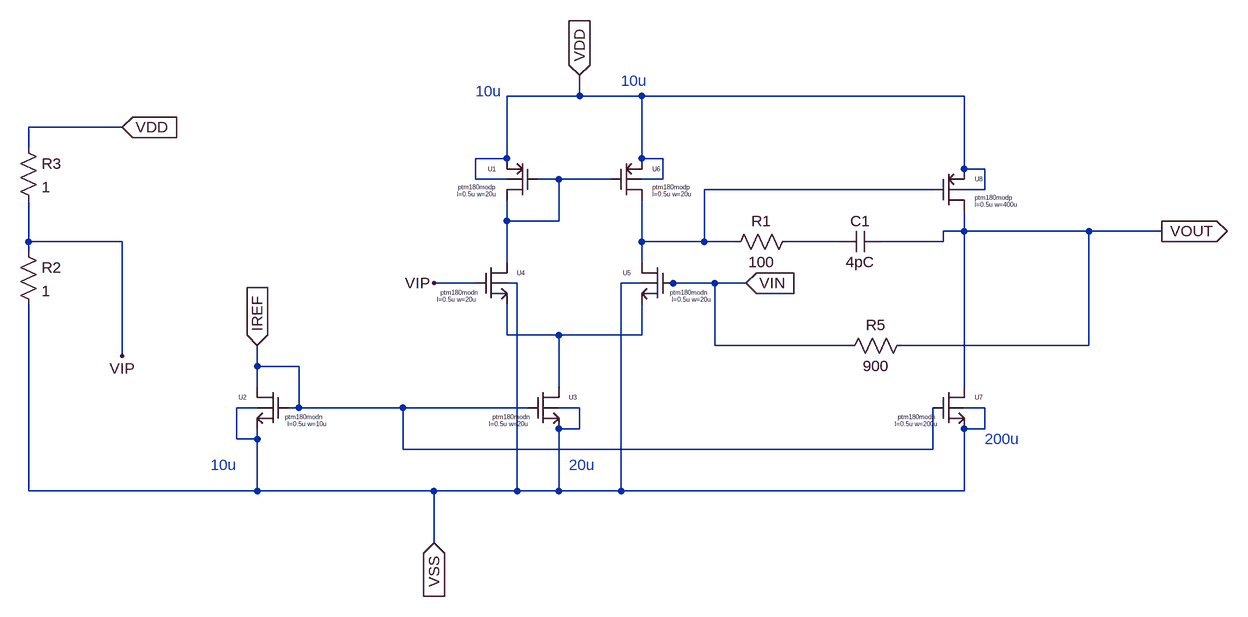
[diagram p0: schematic cm_amp.asc]
cm_amp.asc, the LTspice schematic file:
Version 4
SHEET 1 1404 828
WIRE 400 48 400 16
WIRE 400 48 288 48
WIRE 496 48 400 48
WIRE 992 48 496 48
WIRE -304 96 -448 96
WIRE -448 128 -448 96
WIRE 288 144 288 48
WIRE 288 144 240 144
WIRE 496 144 496 48
WIRE 528 144 496 144
WIRE 992 160 992 48
WIRE 1024 160 992 160
WIRE 240 176 240 144
WIRE 288 176 240 176
WIRE 368 176 336 176
WIRE 448 176 368 176
WIRE 528 176 528 144
WIRE 528 176 496 176
WIRE 944 192 592 192
WIRE 1024 192 1024 160
WIRE 1024 192 992 192
WIRE 288 240 288 208
WIRE 368 240 368 176
WIRE 368 240 288 240
WIRE 992 256 992 224
WIRE 992 256 960 256
WIRE 1184 256 992 256
WIRE 1296 256 1184 256
WIRE -448 272 -448 208
WIRE -304 272 -448 272
WIRE 496 272 496 208
WIRE 592 272 592 192
WIRE 592 272 496 272
WIRE 640 272 592 272
WIRE 800 272 720 272
WIRE 960 272 960 256
WIRE 960 272 864 272
WIRE -448 288 -448 272
WIRE 288 304 288 240
WIRE 496 304 496 272
WIRE 240 336 176 336
WIRE 304 336 288 336
WIRE 496 336 464 336
WIRE 544 336 528 336
WIRE 608 336 544 336
WIRE 656 336 608 336
WIRE 288 416 288 368
WIRE 368 416 288 416
WIRE 496 416 496 368
WIRE 496 416 368 416
WIRE 608 432 608 336
WIRE 816 432 608 432
WIRE 1184 432 1184 256
WIRE 1184 432 896 432
WIRE -304 448 -304 272
WIRE -96 464 -96 432
WIRE -32 464 -96 464
WIRE -96 496 -96 464
WIRE 368 496 368 416
WIRE 992 496 992 256
WIRE -96 528 -128 528
WIRE -32 528 -32 464
WIRE -32 528 -48 528
WIRE 128 528 -32 528
WIRE 320 528 128 528
WIRE 400 528 368 528
WIRE 1024 528 992 528
WIRE 400 560 400 528
WIRE 400 560 368 560
WIRE 1024 560 1024 528
WIRE 1024 560 992 560
WIRE -128 576 -128 528
WIRE -96 576 -96 560
WIRE -96 576 -128 576
WIRE 128 592 128 528
WIRE 944 592 944 528
WIRE 944 592 128 592
WIRE -448 656 -448 368
WIRE -96 656 -96 576
WIRE -96 656 -448 656
WIRE 176 656 -96 656
WIRE 304 656 304 336
WIRE 304 656 176 656
WIRE 368 656 368 560
WIRE 368 656 304 656
WIRE 464 656 464 336
WIRE 464 656 368 656
WIRE 992 656 992 560
WIRE 992 656 464 656
WIRE 176 736 176 656
FLAG -96 432 IREF
IOPIN -96 432 In
FLAG 176 736 VSS
IOPIN 176 736 In
FLAG 400 16 VDD
IOPIN 400 16 In
FLAG 1296 256 VOUT
IOPIN 1296 256 Out
FLAG 656 336 VIN
IOPIN 656 336 In
FLAG 176 336 VIP
FLAG -304 448 VIP
FLAG -304 96 VDD
IOPIN -304 96 In
SYMBOL cnm25mod_pmos4 336 144 M0
SYMATTR SpiceModel ptm180modp
SYMATTR Value l=0.5u w=20u
SYMATTR InstName U1
SYMBOL cnm25mod_nmos4 -48 496 M0
WINDOW 38 -54 46 Left 0
WINDOW 3 -59 57 Left 0
SYMATTR SpiceModel ptm180modn
SYMATTR Value l=0.5u w=10u
SYMATTR InstName U2
SYMBOL cnm25mod_nmos4 320 496 R0
WINDOW 38 -54 46 Left 0
WINDOW 3 -59 57 Left 0
SYMATTR SpiceModel ptm180modn
SYMATTR Value l=0.5u w=20u
SYMATTR InstName U3
SYMBOL cnm25mod_nmos4 240 304 R0
WINDOW 38 -54 46 Left 0
WINDOW 3 -59 57 Left 0
SYMATTR SpiceModel ptm180modn
SYMATTR Value l=0.5u w=20u
SYMATTR InstName U4
SYMBOL cnm25mod_nmos4 544 304 M0
WINDOW 38 -54 46 Left 0
WINDOW 3 -59 57 Left 0
SYMATTR SpiceModel ptm180modn
SYMATTR Value l=0.5u w=20u
SYMATTR InstName U5
SYMBOL cnm25mod_pmos4 448 144 R0
SYMATTR SpiceModel ptm180modp
SYMATTR Value l=0.5u w=20u
SYMATTR InstName U6
SYMBOL cnm25mod_nmos4 944 496 R0
WINDOW 38 -54 46 Left 0
WINDOW 3 -59 57 Left 0
SYMATTR SpiceModel ptm180modn
SYMATTR Value l=0.5u w=200u
SYMATTR InstName U7
SYMBOL cnm25mod_pmos4 944 160 R0
SYMATTR SpiceModel ptm180modp
SYMATTR Value l=0.5u w=400u
SYMATTR InstName U8
SYMBOL res 736 256 R90
WINDOW 0 0 56 VBottom 2
WINDOW 3 32 56 VTop 2
SYMATTR InstName R1
SYMATTR Value 100
SYMBOL cap 864 256 R90
WINDOW 0 0 32 VBottom 2
WINDOW 3 32 32 VTop 2
SYMATTR InstName C1
SYMATTR Value 4pC
SYMBOL res -464 272 R0
SYMATTR InstName R2
SYMATTR Value 1
SYMBOL res -464 112 R0
SYMATTR InstName R3
SYMATTR Value 1
SYMBOL res 912 416 R90
WINDOW 0 0 56 VBottom 2
WINDOW 3 32 56 VTop 2
SYMATTR InstName R5
SYMATTR Value 900
TEXT -168 616 Left 2 ;10u
TEXT 384 616 Left 2 ;20u
TEXT 240 40 Left 2 ;10u
TEXT 464 24 Left 2 ;10u
TEXT 1024 576 Left 2 ;200u

The netlist it stands for:
* cm_amp.asc
XU1 N001 N001 VDD VDD ptm180modp l=0.5u w=20u  ; pins D G S B
XU2 IREF IREF VSS VSS ptm180modn l=0.5u w=10u  ; pins D G S B
XU3 N004 IREF VSS VSS ptm180modn l=0.5u w=20u  ; pins D G S B
XU4 N001 VIP N004 VSS ptm180modn l=0.5u w=20u  ; pins D G S B
XU5 N002 VIN N004 VSS ptm180modn l=0.5u w=20u  ; pins D G S B
XU6 N002 N001 VDD VDD ptm180modp l=0.5u w=20u  ; pins D G S B
XU7 VOUT IREF VSS VSS ptm180modn l=0.5u w=200u  ; pins D G S B
XU8 VOUT N002 VDD VDD ptm180modp l=0.5u w=400u  ; pins D G S B
R1 N003 N002 100
C1 VOUT N003 4pC
R2 VIP VSS 1
R3 VDD VIP 1
R5 VOUT VIN 900
* 10u
* 20u
* 10u
* 10u
* 200u
.backanno
.end